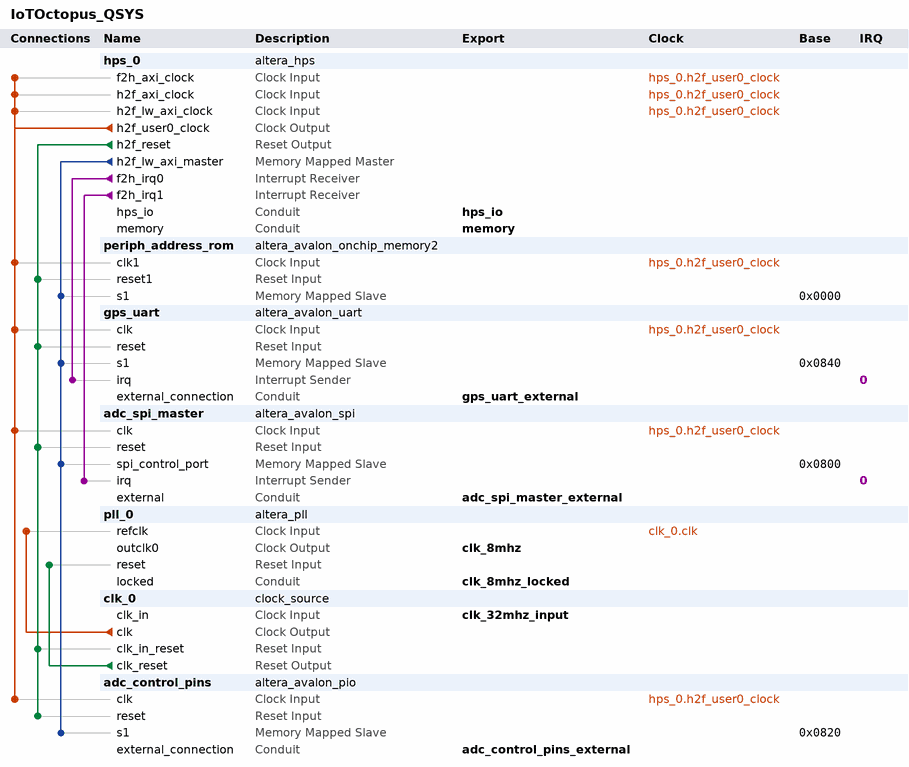
[diagram p0: system contents]
# Platform Designer (Qsys) system IoTOctopus_QSYS, Cyclone V 5CSEMA6F31C8
# Parameters at their usual value, and those the tool derives, are not listed.
package require -exact qsys 18.1
create_system IoTOctopus_QSYS
set_project_property DEVICE_FAMILY {Cyclone V}
set_project_property DEVICE 5CSEMA6F31C8

add_instance hps_0 altera_hps 18.1
set_instance_parameter_value hps_0 CAN0_Mode CAN
set_instance_parameter_value hps_0 CAN0_PinMuxing {HPS I/O Set 1}
set_instance_parameter_value hps_0 CAN1_Mode CAN
set_instance_parameter_value hps_0 CAN1_PinMuxing {HPS I/O Set 0}
set_instance_parameter_value hps_0 EMAC0_Mode RGMII
set_instance_parameter_value hps_0 EMAC0_PinMuxing {HPS I/O Set 0}
set_instance_parameter_value hps_0 EMAC1_Mode N/A
set_instance_parameter_value hps_0 EMAC1_PinMuxing Unused
set_instance_parameter_value hps_0 F2SCLK_COLDRST_Enable false
set_instance_parameter_value hps_0 F2SCLK_DBGRST_Enable false
set_instance_parameter_value hps_0 F2SCLK_WARMRST_Enable false
set_instance_parameter_value hps_0 F2SINTERRUPT_Enable true
set_instance_parameter_value hps_0 F2S_Width 2
set_instance_parameter_value hps_0 FPGA_PERIPHERAL_OUTPUT_CLOCK_FREQ_EMAC0_GTX_CLK 125
set_instance_parameter_value hps_0 FPGA_PERIPHERAL_OUTPUT_CLOCK_FREQ_EMAC0_MD_CLK 2.5
set_instance_parameter_value hps_0 FPGA_PERIPHERAL_OUTPUT_CLOCK_FREQ_EMAC1_GTX_CLK 125
set_instance_parameter_value hps_0 FPGA_PERIPHERAL_OUTPUT_CLOCK_FREQ_EMAC1_MD_CLK 2.5
set_instance_parameter_value hps_0 HPS_PROTOCOL DDR3
set_instance_parameter_value hps_0 I2C0_Mode I2C
set_instance_parameter_value hps_0 I2C0_PinMuxing {HPS I/O Set 0}
set_instance_parameter_value hps_0 I2C1_Mode I2C
set_instance_parameter_value hps_0 I2C1_PinMuxing {HPS I/O Set 0}
set_instance_parameter_value hps_0 I2C3_Mode I2C
set_instance_parameter_value hps_0 I2C3_PinMuxing {HPS I/O Set 0}
set_instance_parameter_value hps_0 LWH2F_Enable true
set_instance_parameter_value hps_0 MEM_BANKADDR_WIDTH 3
set_instance_parameter_value hps_0 MEM_CLK_FREQ 300.0
set_instance_parameter_value hps_0 MEM_CLK_FREQ_MAX 933.333
set_instance_parameter_value hps_0 MEM_COL_ADDR_WIDTH 10
set_instance_parameter_value hps_0 MEM_DQ_WIDTH 32
set_instance_parameter_value hps_0 MEM_DRV_STR RZQ/6
set_instance_parameter_value hps_0 MEM_ROW_ADDR_WIDTH 15
set_instance_parameter_value hps_0 MEM_RTT_NOM RZQ/6
set_instance_parameter_value hps_0 MEM_RTT_WR {Dynamic ODT off}
set_instance_parameter_value hps_0 MEM_TCL 6
set_instance_parameter_value hps_0 MEM_TFAW_NS 33.0
set_instance_parameter_value hps_0 MEM_TRAS_NS 34.0
set_instance_parameter_value hps_0 MEM_TRCD_NS 13.91
set_instance_parameter_value hps_0 MEM_TRFC_NS 260.0
set_instance_parameter_value hps_0 MEM_TRP_NS 13.91
set_instance_parameter_value hps_0 MEM_TRRD_NS 6.0
set_instance_parameter_value hps_0 MEM_TRTP_NS 10.0
set_instance_parameter_value hps_0 MEM_VENDOR Other
set_instance_parameter_value hps_0 MEM_WTCL 5
set_instance_parameter_value hps_0 QSPI_Mode N/A
set_instance_parameter_value hps_0 QSPI_PinMuxing Unused
set_instance_parameter_value hps_0 REF_CLK_FREQ 25.0
set_instance_parameter_value hps_0 S2FCLK_USER0CLK_Enable true
set_instance_parameter_value hps_0 S2FCLK_USER1CLK_FREQ 50.0
set_instance_parameter_value hps_0 S2FCLK_USER2CLK 5
set_instance_parameter_value hps_0 S2F_Width 2
set_instance_parameter_value hps_0 SDIO_Mode {4-bit Data}
set_instance_parameter_value hps_0 SDIO_PinMuxing {HPS I/O Set 0}
set_instance_parameter_value hps_0 SPIM0_Mode {Single Slave Select}
set_instance_parameter_value hps_0 SPIM0_PinMuxing {HPS I/O Set 0}
set_instance_parameter_value hps_0 SPIM1_Mode N/A
set_instance_parameter_value hps_0 SPIM1_PinMuxing Unused
set_instance_parameter_value hps_0 STM_Enable false
set_instance_parameter_value hps_0 TIMING_BOARD_AC_SKEW 0.03
set_instance_parameter_value hps_0 TIMING_BOARD_AC_TO_CK_SKEW 0.0
set_instance_parameter_value hps_0 TIMING_BOARD_DQ_TO_DQS_SKEW 0.0
set_instance_parameter_value hps_0 TIMING_BOARD_MAX_CK_DELAY 0.03
set_instance_parameter_value hps_0 TIMING_BOARD_MAX_DQS_DELAY 0.02
set_instance_parameter_value hps_0 TIMING_BOARD_SKEW_BETWEEN_DQS 0.08
set_instance_parameter_value hps_0 TIMING_BOARD_SKEW_CKDQS_DIMM_MAX 0.16
set_instance_parameter_value hps_0 TIMING_BOARD_SKEW_CKDQS_DIMM_MIN 0.09
set_instance_parameter_value hps_0 TIMING_BOARD_SKEW_WITHIN_DQS 0.01
set_instance_parameter_value hps_0 TIMING_TDH 75
set_instance_parameter_value hps_0 TIMING_TDQSCK 195
set_instance_parameter_value hps_0 TIMING_TDQSQ 85
set_instance_parameter_value hps_0 TIMING_TDQSS 0.27
set_instance_parameter_value hps_0 TIMING_TDS 70
set_instance_parameter_value hps_0 TIMING_TDSH 0.18
set_instance_parameter_value hps_0 TIMING_TDSS 0.18
set_instance_parameter_value hps_0 TIMING_TIH 140
set_instance_parameter_value hps_0 TIMING_TIS 180
set_instance_parameter_value hps_0 TIMING_TQSH 0.45
set_instance_parameter_value hps_0 UART0_Mode {No Flow Control}
set_instance_parameter_value hps_0 UART0_PinMuxing {HPS I/O Set 1}
set_instance_parameter_value hps_0 USB1_Mode N/A
set_instance_parameter_value hps_0 USB1_PinMuxing Unused
set_instance_parameter_value hps_0 desired_cfg_clk_mhz 100.0
set_instance_parameter_value hps_0 desired_qspi_clk_mhz 400.0

add_instance periph_address_rom altera_avalon_onchip_memory2 18.1
set_instance_parameter_value periph_address_rom dataWidth 32
set_instance_parameter_value periph_address_rom dualPort false
set_instance_parameter_value periph_address_rom initMemContent true
set_instance_parameter_value periph_address_rom initializationFileName /home/andrey/FYP/PMU-FYP/IoTOctopus/Sources/rom_memory.hex
set_instance_parameter_value periph_address_rom memorySize 48
set_instance_parameter_value periph_address_rom useNonDefaultInitFile true
set_instance_parameter_value periph_address_rom writable false

add_instance gps_uart altera_avalon_uart 18.1
set_instance_parameter_value gps_uart baud 4800
set_instance_parameter_value gps_uart dataBits 8
set_instance_parameter_value gps_uart fixedBaud true
set_instance_parameter_value gps_uart parity NONE
set_instance_parameter_value gps_uart stopBits 1

add_instance adc_spi_master altera_avalon_spi 18.1
set_instance_parameter_value adc_spi_master clockPolarity 0
set_instance_parameter_value adc_spi_master dataWidth 32
set_instance_parameter_value adc_spi_master insertSync true
set_instance_parameter_value adc_spi_master masterSPI true
set_instance_parameter_value adc_spi_master numberOfSlaves 1
set_instance_parameter_value adc_spi_master targetClockRate 1024000

add_instance pll_0 altera_pll 18.1
set_instance_parameter_value pll_0 gui_device_speed_grade 1
set_instance_parameter_value pll_0 gui_number_of_clocks 1
set_instance_parameter_value pll_0 gui_operation_mode direct
set_instance_parameter_value pll_0 gui_output_clock_frequency0 8.192
set_instance_parameter_value pll_0 gui_pll_mode {Integer-N PLL}
set_instance_parameter_value pll_0 gui_reference_clock_frequency 32.768
set_instance_parameter_value pll_0 gui_use_locked true

add_instance clk_0 clock_source 18.1
set_instance_parameter_value clk_0 clockFrequency 32768000

add_instance adc_control_pins altera_avalon_pio 18.1
set_instance_parameter_value adc_control_pins direction Output
set_instance_parameter_value adc_control_pins resetValue 97
set_instance_parameter_value adc_control_pins width 7

# connections
add_connection clk_0.clk pll_0.refclk clock
add_connection hps_0.h2f_user0_clock adc_control_pins.clk clock
add_connection hps_0.h2f_user0_clock adc_spi_master.clk clock
add_connection hps_0.h2f_user0_clock gps_uart.clk clock
add_connection hps_0.h2f_user0_clock hps_0.f2h_axi_clock clock
add_connection hps_0.h2f_user0_clock hps_0.h2f_axi_clock clock
add_connection hps_0.h2f_user0_clock hps_0.h2f_lw_axi_clock clock
add_connection hps_0.h2f_user0_clock periph_address_rom.clk1 clock
add_connection clk_0.clk_reset pll_0.reset reset
add_connection hps_0.h2f_reset adc_control_pins.reset reset
add_connection hps_0.h2f_reset adc_spi_master.reset reset
add_connection hps_0.h2f_reset clk_0.clk_in_reset reset
add_connection hps_0.h2f_reset gps_uart.reset reset
add_connection hps_0.h2f_reset periph_address_rom.reset1 reset
add_connection hps_0.h2f_lw_axi_master adc_control_pins.s1 avalon
set_connection_parameter_value hps_0.h2f_lw_axi_master/adc_control_pins.s1 baseAddress 0x0820
add_connection hps_0.h2f_lw_axi_master adc_spi_master.spi_control_port avalon
set_connection_parameter_value hps_0.h2f_lw_axi_master/adc_spi_master.spi_control_port baseAddress 0x0800
add_connection hps_0.h2f_lw_axi_master gps_uart.s1 avalon
set_connection_parameter_value hps_0.h2f_lw_axi_master/gps_uart.s1 baseAddress 0x0840
add_connection hps_0.h2f_lw_axi_master periph_address_rom.s1 avalon
set_connection_parameter_value hps_0.h2f_lw_axi_master/periph_address_rom.s1 baseAddress 0x0000
add_connection hps_0.f2h_irq0 gps_uart.irq interrupt
set_connection_parameter_value hps_0.f2h_irq0/gps_uart.irq irqNumber 0
add_connection hps_0.f2h_irq1 adc_spi_master.irq interrupt
set_connection_parameter_value hps_0.f2h_irq1/adc_spi_master.irq irqNumber 0

# exported interfaces
add_interface adc_control_pins_external conduit end
set_interface_property adc_control_pins_external EXPORT_OF adc_control_pins.external_connection
add_interface adc_spi_master_external conduit end
set_interface_property adc_spi_master_external EXPORT_OF adc_spi_master.external
add_interface clk_32mhz_input clock sink
set_interface_property clk_32mhz_input EXPORT_OF clk_0.clk_in
add_interface clk_8mhz clock source
set_interface_property clk_8mhz EXPORT_OF pll_0.outclk0
add_interface clk_8mhz_locked conduit end
set_interface_property clk_8mhz_locked EXPORT_OF pll_0.locked
add_interface gps_uart_external conduit end
set_interface_property gps_uart_external EXPORT_OF gps_uart.external_connection
add_interface hps_io conduit end
set_interface_property hps_io EXPORT_OF hps_0.hps_io
add_interface memory conduit end
set_interface_property memory EXPORT_OF hps_0.memory

set_interconnect_requirement {$system} qsys_mm.clockCrossingAdapter HANDSHAKE
set_interconnect_requirement {$system} qsys_mm.enableEccProtection FALSE
set_interconnect_requirement {$system} qsys_mm.insertDefaultSlave FALSE
set_interconnect_requirement {$system} qsys_mm.maxAdditionalLatency 1

save_system IoTOctopus_QSYS.qsys
